# Altium project Current_source_koncar.PrjPcb (part 3 of 4)

## Sheet power.SchDoc
size 381 x 241 mm; SheetNumber: 6; SheetTotal: 12
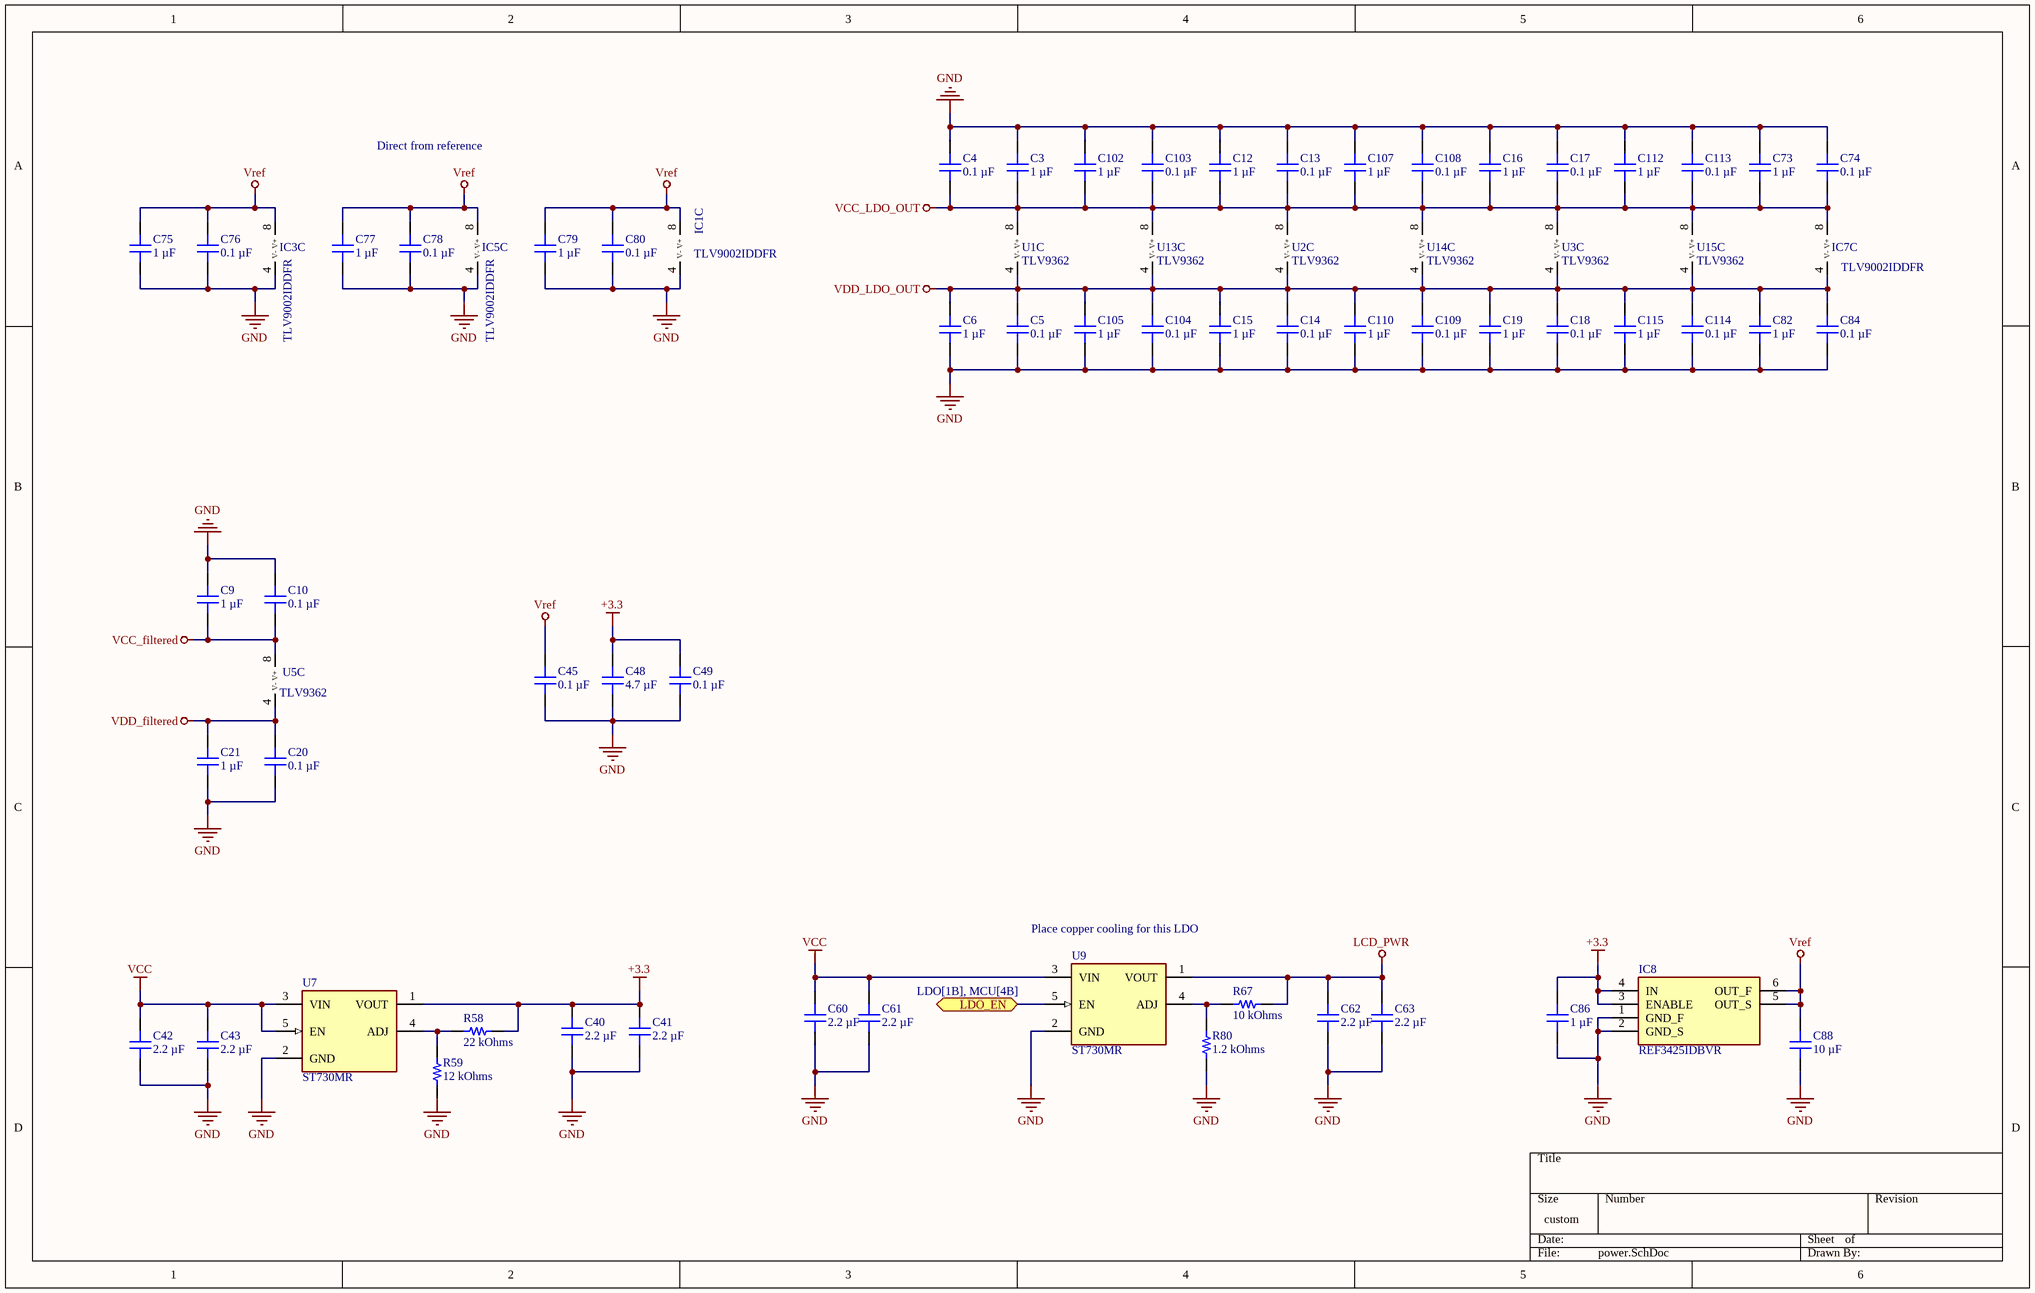
[diagram p5: power.SchDoc]

### Parts
C3  1 µF  [CAP 1206_3216 - 0.8MM]
C4  0.1 µF  [CAP 1206_3216 - 0.8MM]
C5  0.1 µF  [CAP 1206_3216 - 0.8MM]
C6  1 µF  [CAP 1206_3216 - 0.8MM]
C9  1 µF  [CAP 1206_3216 - 0.8MM]
C10  0.1 µF  [CAP 1206_3216 - 0.8MM]
C12  1 µF  [CAP 1206_3216 - 0.8MM]
C13  0.1 µF  [CAP 1206_3216 - 0.8MM]
C14  0.1 µF  [CAP 1206_3216 - 0.8MM]
C15  1 µF  [CAP 1206_3216 - 0.8MM]
C16  1 µF  [CAP 1206_3216 - 0.8MM]
C17  0.1 µF  [CAP 1206_3216 - 0.8MM]
C18  0.1 µF  [CAP 1206_3216 - 0.8MM]
C19  1 µF  [CAP 1206_3216 - 0.8MM]
C20  0.1 µF  [CAP 1206_3216 - 0.8MM]
C21  1 µF  [CAP 1206_3216 - 0.8MM]
C40  2.2 µF  [CAP 1206_3216 - 0.8MM]
C41  2.2 µF  [CAP 1206_3216 - 0.8MM]
C42  2.2 µF  [CAP 1206_3216 - 0.8MM]
C43  2.2 µF  [CAP 1206_3216 - 0.8MM]
C45  0.1 µF  [CAP 1206_3216 - 0.8MM]
C48  4.7 µF  [CAP 1206_3216 - 0.8MM]
C49  0.1 µF  [CAP 1206_3216 - 0.8MM]
C60  2.2 µF  [CAP 1206_3216 - 0.8MM]
C61  2.2 µF  [CAP 1206_3216 - 0.8MM]
C62  2.2 µF  [CAP 1206_3216 - 0.8MM]
C63  2.2 µF  [CAP 1206_3216 - 0.8MM]
C73  1 µF  [CAP 1206_3216 - 0.8MM]
C74  0.1 µF  [CAP 1206_3216 - 0.8MM]
C75  1 µF  [CAP 1206_3216 - 0.8MM]
C76  0.1 µF  [CAP 1206_3216 - 0.8MM]
C77  1 µF  [CAP 1206_3216 - 0.8MM]
C78  0.1 µF  [CAP 1206_3216 - 0.8MM]
C79  1 µF  [CAP 1206_3216 - 0.8MM]
C80  0.1 µF  [CAP 1206_3216 - 0.8MM]
C82  1 µF  [CAP 1206_3216 - 0.8MM]
C84  0.1 µF  [CAP 1206_3216 - 0.8MM]
C86  1 µF  [CAP 1206_3216 - 0.8MM]
C88  10 µF  [CAP 1206_3216 - 0.8MM]
C102  1 µF  [CAP 1206_3216 - 0.8MM]
C103  0.1 µF  [CAP 1206_3216 - 0.8MM]
C104  0.1 µF  [CAP 1206_3216 - 0.8MM]
C105  1 µF  [CAP 1206_3216 - 0.8MM]
C107  1 µF  [CAP 1206_3216 - 0.8MM]
C108  0.1 µF  [CAP 1206_3216 - 0.8MM]
C109  0.1 µF  [CAP 1206_3216 - 0.8MM]
C110  1 µF  [CAP 1206_3216 - 0.8MM]
C112  1 µF  [CAP 1206_3216 - 0.8MM]
C113  0.1 µF  [CAP 1206_3216 - 0.8MM]
C114  0.1 µF  [CAP 1206_3216 - 0.8MM]
C115  1 µF  [CAP 1206_3216 - 0.8MM]
IC1  TLV9002IDDFR  [SOT65P280X110-8N]  (part C of 3)
IC3  TLV9002IDDFR  [SOT65P280X110-8N]  (part C of 3)
IC5  TLV9002IDDFR  [SOT65P280X110-8N]  (part C of 3)
IC7  TLV9002IDDFR  [SOT65P280X110-8N]  (part C of 3)
IC8  REF3425IDBVR  [SOT95P280X145-6N]
R58  22 kOhms  [YAGEO RES 1206_3216]
R59  12 kOhms  [YAGEO RES 1206_3216]
R67  10 kOhms  [YAGEO RES 1206_3216]
R80  1.2 kOhms  [YAGEO RES 1206_3216]
U1  TLV9362  [SOIC8-127P600X175-8N]  (part C of 3)
U2  TLV9362  [SOIC8-127P600X175-8N]  (part C of 3)
U3  TLV9362  [SOIC8-127P600X175-8N]  (part C of 3)
U5  TLV9362  [SOIC8-127P600X175-8N]  (part C of 3)
U7  ST730MR  [FP-UJ-5-IPC_B]
U9  ST730MR  [FP-UJ-5-IPC_B]
U13  TLV9362  [SOIC8-127P600X175-8N]  (part C of 3)
U14  TLV9362  [SOIC8-127P600X175-8N]  (part C of 3)
U15  TLV9362  [SOIC8-127P600X175-8N]  (part C of 3)

### Ports
LDO_EN (bidir, see LDO[1B], MCU[4B])

### Nets
+3.3: C40.2 C41.2 C48.2 C49.2 C86.2 IC8.3(ENABLE) IC8.4(IN) R58.2 U7.1(VOUT)
GND: C3.1 C4.1 C5.2 C6.2 C9.2 C10.2 C12.2 C13.2 C14.2 C15.2 C16.2 C17.2 C18.2 C19.2 C20.1 C21.1 C40.1 C41.1 C42.1 C43.1 C45.1 C48.1 C49.1 C60.1 C61.1 C62.1 C63.1 C73.2 C74.2 C75.1 C76.1 C77.1 C78.1 C79.1 C80.1 C82.2 C84.2 C86.1 C88.1 C102.2 C103.2 C104.2 C105.2 C107.2 C108.2 C109.2 C110.2 C112.2 C113.2 C114.2 C115.2 IC1.4(V-) IC3.4(V-) IC5.4(V-) IC8.1(GND_F) IC8.2(GND_S) R59.2 R80.2 U7.2(GND) U9.2(GND)
LCD_PWR: C62.2 C63.2 R67.2 U9.1(VOUT)
VCC: C42.2 C43.2 C60.2 C61.2 U7.3(VIN) U7.5(EN) U9.3(VIN)
VCC_filtered: C9.1 C10.1 U5.8(V+)
VCC_LDO_OUT: C3.2 C4.2 C12.1 C13.1 C16.1 C17.1 C73.1 C74.1 C102.1 C103.1 C107.1 C108.1 C112.1 C113.1 IC7.8(V+) U1.8(V+) U2.8(V+) U3.8(V+) U13.8(V+) U14.8(V+) U15.8(V+)
VDD_filtered: C20.2 C21.2 U5.4(V-)
VDD_LDO_OUT: C5.1 C6.1 C14.1 C15.1 C18.1 C19.1 C82.1 C84.1 C104.1 C105.1 C109.1 C110.1 C114.1 C115.1 IC7.4(V-) U1.4(V-) U2.4(V-) U3.4(V-) U13.4(V-) U14.4(V-) U15.4(V-)
Vref: C45.2 C75.2 C76.2 C77.2 C78.2 C79.2 C80.2 C88.2 IC1.8(V+) IC3.8(V+) IC5.8(V+) IC8.5(OUT_S) IC8.6(OUT_F)
LDO_EN: U9.5(EN) ; port LDO_EN
NetR58_1: R58.1 R59.1 U7.4(ADJ)
NetR67_1: R67.1 R80.1 U9.4(ADJ)

### Notes on the sheet
- Direct from reference
- (near U9) Place copper cooling for this LDO

### Library data of the parts
C3 C6 C9 C12 C15 C16 C19 C21 C73 C75 C77 C79 C82 C86 C102 C105 C107 C110 C112 C115 = 885012208093: CAP CER 1UF 50V X7R 1206; manufacturer: Würth Elektronik; Tolerance: ±10%; Part Number: 885012208093; Capacitance: 1 µF; Applications: General Purpose; componentlink1description: Datasheet; componentlink1url: https://katalog.we-online.de/pbs/datasheet/885012208093.pdf; componentlink2description: DigiKey Link; componentlink2url: https://www.digikey.com/en/products/detail/würth-elektronik/885012208093/5453432; Device Package: 1206 (3216 Metric); lastupdated: 6/4/2024 19:10:33; Lifecycle Status: Active; Minimum Order: 1; Mounting Type: Surface Mount, MLCC; Operating Temperature: -55°C ~ 125°C; Package / Case: 1206 (3216 Metric); packaging: TapeAndReel; partid: 39665; Part Status: Active; price: 0.10; series: WCAP-CSGP; Size / Dimension: 0.126" L x 0.063" W (3.20mm x 1.60mm); Supplier 1: DigiKey; Supplier Part Number 1: 732-7577-1-ND; Temperature Coefficient: X7R; Thickness (Max): 0.075" (1.90mm); value: 1 µF; Voltage - Rated: 50V
C4 C5 C10 C13 C14 C17 C18 C20 C45 C49 C74 C76 C78 C80 C84 C103 C104 C108 C109 C113 C114 = 885012208087: CAP CER 0.1UF 50V X7R 1206; manufacturer: Würth Elektronik; Tolerance: ±10%; Part Number: 885012208087; Capacitance: 0.1 µF; Applications: General Purpose; componentlink1description: Datasheet; componentlink1url: https://katalog.we-online.de/pbs/datasheet/885012208087.pdf; componentlink2description: DigiKey Link; componentlink2url: https://www.digikey.com/en/products/detail/würth-elektronik/885012208087/5453982; Device Package: 1206 (3216 Metric); lastupdated: 6/4/2024 19:10:27; Lifecycle Status: Active; Minimum Order: 1; Mounting Type: Surface Mount, MLCC; Operating Temperature: -55°C ~ 125°C; Package / Case: 1206 (3216 Metric); packaging: TapeAndReel; partid: 20879; Part Status: Active; price: 0.06; series: WCAP-CSGP; Size / Dimension: 0.126" L x 0.063" W (3.20mm x 1.60mm); Supplier 1: DigiKey; Supplier Part Number 1: 732-8127-1-ND; Temperature Coefficient: X7R; Thickness (Max): 0.035" (0.90mm); value: 0.1 µF; Voltage - Rated: 50V
C40-C43 C60-C63 = 885382208001: CAP CER 2.2UF 25V X7R 1206; manufacturer: Würth Elektronik; Tolerance: ±10%; Part Number: 885382208001; Capacitance: 2.2 µF; Applications: Boardflex Sensitive; componentlink2description: DigiKey Link; componentlink2url: https://www.digikey.com/en/products/detail/würth-elektronik/885382208001/9816354; Device Package: 1206 (3216 Metric); Features: Soft Termination; lastupdated: 6/4/2024 19:10:38; Lifecycle Status: Active; Minimum Order: 1; Mounting Type: Surface Mount, MLCC; Operating Temperature: -55°C ~ 125°C; Package / Case: 1206 (3216 Metric); packaging: TapeAndReel; partid: 45904; Part Status: Active; price: 0.35; series: WCAP-CSST; Size / Dimension: 0.126" L x 0.063" W (3.20mm x 1.60mm); Supplier 1: DigiKey; Supplier Part Number 1: 732-13199-1-ND; Temperature Coefficient: X7R; Thickness (Max): 0.083" (2.10mm); value: 2.2 µF; Voltage - Rated: 25V
C48 = 885012208094: CAP CER 4.7UF 50V X7R 1206; manufacturer: Würth Elektronik; Tolerance: ±10%; Part Number: 885012208094; Capacitance: 4.7 µF; Applications: General Purpose; componentlink1description: Datasheet; componentlink1url: https://katalog.we-online.de/pbs/datasheet/885012208094.pdf; componentlink2description: DigiKey Link; componentlink2url: https://www.digikey.com/en/products/detail/würth-elektronik/885012208094/5453433; Device Package: 1206 (3216 Metric); lastupdated: 6/4/2024 19:10:35; Lifecycle Status: Active; Minimum Order: 1; Mounting Type: Surface Mount, MLCC; Operating Temperature: -55°C ~ 125°C; Package / Case: 1206 (3216 Metric); packaging: TapeAndReel; partid: 31399; Part Status: Active; price: 0.36; series: WCAP-CSGP; Size / Dimension: 0.126" L x 0.063" W (3.20mm x 1.60mm); Supplier 1: DigiKey; Supplier Part Number 1: 732-7578-1-ND; Temperature Coefficient: X7R; Thickness (Max): 0.075" (1.90mm); value: 4.7 µF; Voltage - Rated: 50V
C88 = 885012208069: CAP CER 10UF 25V X7R 1206; manufacturer: Würth Elektronik; Tolerance: ±10%; Part Number: 885012208069; Capacitance: 10 µF; Applications: General Purpose; componentlink1description: Datasheet; componentlink1url: https://katalog.we-online.de/pbs/datasheet/885012208069.pdf; componentlink2description: DigiKey Link; componentlink2url: https://www.digikey.com/en/products/detail/würth-elektronik/885012208069/5453429; Device Package: 1206 (3216 Metric); lastupdated: 6/4/2024 19:10:32; Lifecycle Status: Active; Minimum Order: 1; Mounting Type: Surface Mount, MLCC; Operating Temperature: -55°C ~ 125°C; Package / Case: 1206 (3216 Metric); packaging: TapeAndReel; partid: 43199; Part Status: Active; price: 0.40; series: WCAP-CSGP; Size / Dimension: 0.126" L x 0.063" W (3.20mm x 1.60mm); Supplier 1: DigiKey; Supplier Part Number 1: 732-7574-1-ND; Temperature Coefficient: X7R; Thickness (Max): 0.075" (1.90mm); value: 10 µF; Voltage - Rated: 25V
IC1 IC3 IC5 IC7 = TLV9002IDDFR: Integrated Circuit; Manufacturer_Name: Texas Instruments; Datasheet Link: https://www.ti.com/lit/gpn/TLV9002; Height: 1.1mm; Manufacturer_Part_Number: TLV9002IDDFR; Mouser Part Number: 595-TLV9002IDDFR; Mouser Price/Stock: https://www.mouser.co.uk/ProductDetail/Texas-Instruments/TLV9002IDDFR?qs=mAH9sUMRCtuVJ6NmNV%252Bgrw%3D%3D; Arrow Part Number: TLV9002IDDFR; Arrow Price/Stock: https://www.arrow.com/en/products/tlv9002iddfr/texas-instruments?utm_currency=USD&region=nac
IC8 = REF3425IDBVR: Integrated Circuit; Manufacturer_Name: Texas Instruments; Datasheet Link: http://www.ti.com/lit/ds/symlink/ref3425.pdf; Height: 1.45mm; Manufacturer_Part_Number: REF3425IDBVR; Mouser Part Number: 595-REF3425IDBVR; Mouser Price/Stock: https://www.mouser.co.uk/ProductDetail/Texas-Instruments/REF3425IDBVR?qs=YCa%2FAAYMW01YJo5s3bO8wA%3D%3D; Arrow Part Number: REF3425IDBVR; Arrow Price/Stock: https://www.arrow.com/en/products/ref3425idbvr/texas-instruments?region=nac
R58 = RT1206FRE0722KL: RES SMD 22K OHM 1% 1/4W 1206; Manufacturer: Yageo; Power (Watts): 0.25W, 1/4W; Temperature Coefficient: ±50ppm/°C; Part Number: RT1206FRE0722KL; ComponentLink1Description: Datasheet; ComponentLink1URL: https://www.yageo.com/upload/media/product/productsearch/datasheet/rchip/PYu-RT_1-to-0.01_RoHS_L_12.pdf; ComponentLink2Description: DigiKey Link; ComponentLink2URL: https://www.digikey.com/en/products/detail/yageo/RT1206FRE0722KL/1083042; Composition: Thin Film; Device Package: 1206 (3216 Metric); Height - Seated (Max): 0.026" (0.65mm); LastUpdated: 7/25/2024 09:21:19; Lifecycle Status: Active; Minimum Order: 1; Number of Terminations: 2; Operating Temperature: -55°C ~ 155°C; Package / Case: 1206 (3216 Metric); Packaging: TapeAndReel; PartId: 69172; Price: 0.01; Resistance: 22 kOhms; Series: RT; Size / Dimension: 0.122" L x 0.063" W (3.10mm x 1.60mm); Supplier 1: DigiKey; Supplier Part Number 1: 13-RT1206FRE0722KLCT-ND; Supplier Device Package: 1206; Tolerance: ±1%; Value: 22 kOhms; Part Status: Active
R59 = RT1206FRE0712KL: RES SMD 12K OHM 1% 1/4W 1206; Manufacturer: Yageo; Power (Watts): 0.25W, 1/4W; Temperature Coefficient: ±50ppm/°C; Part Number: RT1206FRE0712KL; ComponentLink1Description: Datasheet; ComponentLink1URL: https://www.yageo.com/upload/media/product/productsearch/datasheet/rchip/PYu-RT_1-to-0.01_RoHS_L_12.pdf; ComponentLink2Description: DigiKey Link; ComponentLink2URL: https://www.digikey.com/en/products/detail/yageo/RT1206FRE0712KL/1082900; Composition: Thin Film; Device Package: 1206 (3216 Metric); Height - Seated (Max): 0.026" (0.65mm); LastUpdated: 7/25/2024 09:21:22; Lifecycle Status: Active; Minimum Order: 1; Number of Terminations: 2; Operating Temperature: -55°C ~ 155°C; Package / Case: 1206 (3216 Metric); Packaging: TapeAndReel; PartId: 58377; Part Status: Active; Price: 0.01; Resistance: 12 kOhms; Series: RT; Size / Dimension: 0.122" L x 0.063" W (3.10mm x 1.60mm); Supplier 1: DigiKey; Supplier Part Number 1: 13-RT1206FRE0712KLCT-ND; Supplier Device Package: 1206; Tolerance: ±1%; Value: 12 kOhms
R67 = RT1206FRE0710KL: RES SMD 10K OHM 1% 1/4W 1206; Manufacturer: Yageo; Power (Watts): 0.25W, 1/4W; Temperature Coefficient: ±50ppm/°C; Part Number: RT1206FRE0710KL; ComponentLink1Description: Datasheet; ComponentLink1URL: https://www.yageo.com/upload/media/product/productsearch/datasheet/rchip/PYu-RT_1-to-0.01_RoHS_L_11.pdf; ComponentLink2Description: DigiKey Link; ComponentLink2URL: https://www.digikey.com/en/products/detail/yageo/RT1206FRE0710KL/1082868; Composition: Thin Film; Device Package: 1206 (3216 Metric); Height - Seated (Max): 0.026" (0.65mm); LastUpdated: 7/25/2024 09:21:28; Lifecycle Status: Active; Minimum Order: 1; Number of Terminations: 2; Operating Temperature: -55°C ~ 155°C; Package / Case: 1206 (3216 Metric); Packaging: TapeAndReel; PartId: 38903; Part Status: Active; Price: 0.01; Resistance: 10 kOhms; Series: RT; Size / Dimension: 0.122" L x 0.063" W (3.10mm x 1.60mm); Supplier 1: DigiKey; Supplier Part Number 1: YAG1242CT-ND; Supplier Device Package: 1206; Tolerance: ±1%; Value: 10 kOhms
R80 = RT1206FRE071K2L: RES SMD 1.2K OHM 1% 1/4W 1206; Manufacturer: Yageo; Power (Watts): 0.25W, 1/4W; Temperature Coefficient: ±50ppm/°C; Part Number: RT1206FRE071K2L; ComponentLink1Description: Datasheet; ComponentLink1URL: https://www.yageo.com/upload/media/product/productsearch/datasheet/rchip/PYu-RT_1-to-0.01_RoHS_L_12.pdf; ComponentLink2Description: DigiKey Link; ComponentLink2URL: https://www.digikey.com/en/products/detail/yageo/RT1206FRE071K2L/1082995; Composition: Thin Film; Device Package: 1206 (3216 Metric); Height - Seated (Max): 0.026" (0.65mm); LastUpdated: 7/25/2024 09:21:22; Lifecycle Status: Active; Minimum Order: 1; Number of Terminations: 2; Operating Temperature: -55°C ~ 155°C; Package / Case: 1206 (3216 Metric); Packaging: TapeAndReel; PartId: 58383; Part Status: Active; Price: 0.01; Resistance: 1.2 kOhms; Series: RT; Size / Dimension: 0.122" L x 0.063" W (3.10mm x 1.60mm); Supplier 1: DigiKey; Supplier Part Number 1: 13-RT1206FRE071K2LCT-ND; Supplier Device Package: 1206; Tolerance: ±1%; Value: 1.2 kOhms
U1-U3 U5 U13-U15 = TLV9362: TLV936x 10-MHz, 40-V, RRO, Operational Amplifie; ComponentLink1Description: Datasheet; ComponentLink1URL: https://www.ti.com/lit/ds/symlink/tlv9362.pdf

## Sheet MCU.SchDoc
size A; SheetNumber: 7; SheetTotal: 10
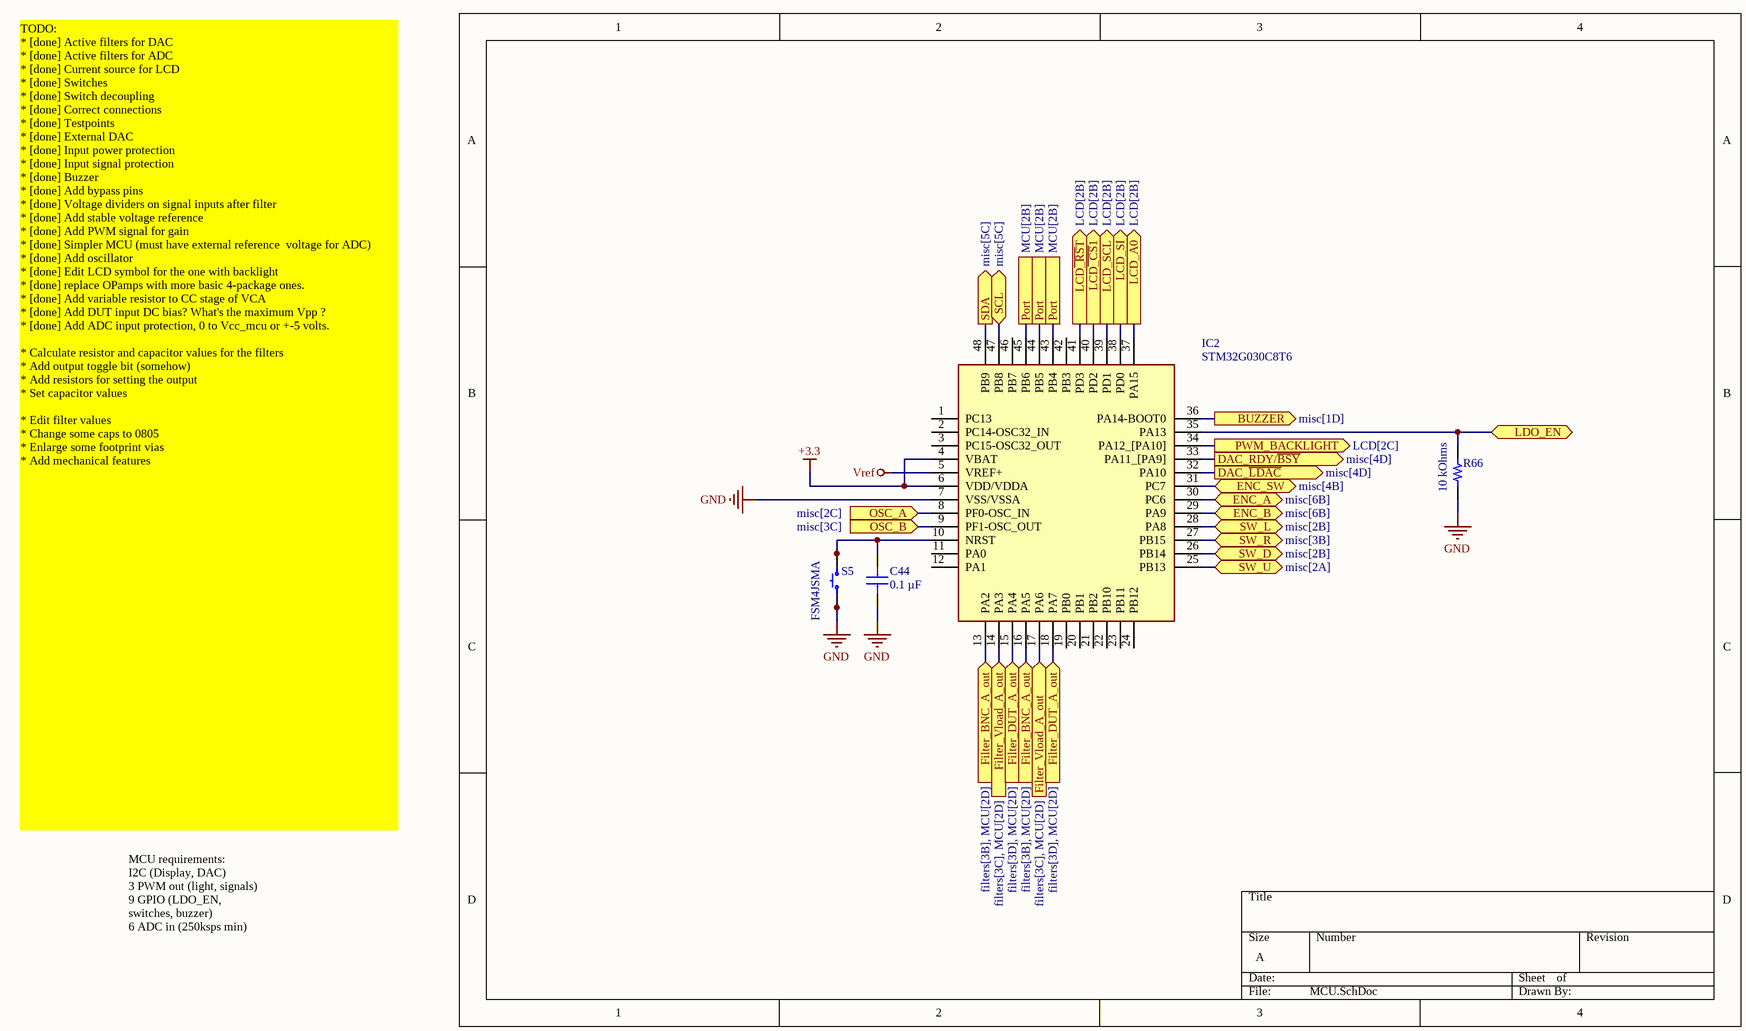
[diagram p6: MCU.SchDoc]

### Parts
C44  0.1 µF  [CAP 1206_3216 - 0.8MM]
IC2  STM32G030C8T6  [QFP50P900X900X160-48N]
R66  10 kOhms  [YAGEO RES 1206_3216]
S5  FSM4JSMA  [TE FSM4JSMA]

### Ports
BUZZER (out, see misc[1D]), DAC_RDY/~{BSY} (out, see misc[4D]), DAC_~{LDAC} (out, see misc[4D]), ENC_A (bidir, see misc[6B]), ENC_B (bidir, see misc[6B]), ENC_SW (bidir, see misc[4B]), Filter_BNC_A_out (in, see filters[3B], MCU[2D]), Filter_DUT_A_out (in, see filters[3D], MCU[2D]), Filter_Vload_A_out (in, see filters[3C], MCU[2D]), LCD_A0 (out, see LCD[2B]), LCD_SCL (out, see LCD[2B]), LCD_SI (out, see LCD[2B]), LCD~{_CS}1 (out, see LCD[2B]), LCD~{_RS}T (out, see LCD[2B]), LDO_EN (bidir, see LDO[3B], LDO[3C], power[3D]), OSC_A (in, see misc[2C]), OSC_B (in, see misc[3C]), Port (see MCU[2B]), PWM_BACKLIGHT (out, see LCD[2C]), SCL (bidir, see misc[5C]), SDA (out, see misc[5C]), SW_D (bidir, see misc[2B]), SW_L (bidir, see misc[2B]), SW_R (bidir, see misc[3B]), SW_U (bidir, see misc[2A])

### Nets
+3.3: IC2.4(VBAT) IC2.6(VDD/VDDA)
GND: C44.1 IC2.7(VSS/VSSA) R66.2 S5.1 S5.2
Vref: IC2.5(VREF+)
LCD~{_CS}1: IC2.40(PD2) ; port LCD~{_CS}1
LCD~{_RS}T: IC2.41(PD3) ; port LCD~{_RS}T
LCD_A0: IC2.37(PA15) ; port LCD_A0
LCD_SCL: IC2.39(PD1) ; port LCD_SCL
LCD_SI: IC2.38(PD0) ; port LCD_SI
LDO_EN: IC2.35(PA13) R66.1 ; port LDO_EN
NetC44_2: C44.2 IC2.10(NRST) S5.3 S5.4
NetC52_1: IC2.8(PF0-OSC_IN) ; port OSC_A
NetC53_2: IC2.9(PF1-OSC_OUT) ; port OSC_B
NetC69_2: IC2.29(PA9) ; port ENC_B
NetC70_2: IC2.30(PC6) ; port ENC_A
NetC81_1: IC2.14(PA3) IC2.17(PA6) ; port Filter_Vload_A_out
NetC85_1: IC2.15(PA4) IC2.18(PA7) ; port Filter_DUT_A_out
NetC?#3_1: IC2.13(PA2) IC2.16(PA5) ; port Filter_BNC_A_out
NetIC2_25: IC2.25(PB13) ; port SW_U
NetIC2_26: IC2.26(PB14) ; port SW_D
NetIC2_27: IC2.27(PB15) ; port SW_R
NetIC2_28: IC2.28(PA8) ; port SW_L
NetIC2_31: IC2.31(PC7) ; port ENC_SW
NetIC2_32: IC2.32(PA10) ; port DAC_~{LDAC}
NetIC2_33: IC2.33(PA11_[PA9]) ; port DAC_RDY/~{BSY}
NetIC2_34: IC2.34(PA12_[PA10]) ; port PWM_BACKLIGHT
NetIC2_36: IC2.36(PA14-BOOT0) ; port BUZZER
NetIC2_43: IC2.43(PB4) IC2.44(PB5) IC2.45(PB6) ; port Port
NetIC2_47: IC2.47(PB8) ; port SCL
NetIC2_48: IC2.48(PB9) ; port SDA

Not connected (* = marked no-connect by the designer): IC2 1(PC13) 2(PC14-OSC32_IN) 3(PC15-OSC32_OUT) 11(PA0) 12(PA1) 19(PB0) 20(PB1) 21(PB2) 22(PB10) 23(PB11) 24(PB12) 42(PB3) 46(PB7)

### Notes on the sheet
- TODO:
  * [done] Active filters for DAC
  * [done] Active filters for ADC
  * [done] Current source for LCD
  * [done] Switches
  * [done] Switch decoupling
  * [done] Correct connections
  * [done] Testpoints
  * [done] External DAC
  * [done] Input power protection
  * [done] Input signal protection
  * [done] Buzzer
  * [done] Add bypass pins
  * [done] Voltage dividers on signal inputs after filter
  * [done] Add stable voltage reference
  * [done] Add PWM signal for gain
  * [done] Simpler MCU (must have external reference  voltage for ADC)
  * [done] Add oscillator
  * [done] Edit LCD symbol for the one with backlight
  * [done] replace OPamps with more basic 4-package ones.
  * [done] Add variable resistor to CC stage of VCA
  * [done] Add DUT input DC bias? What's the maximum Vpp ?
  * [done] Add ADC input protection, 0 to Vcc_mcu or +-5 volts.
  * Calculate resistor and capacitor values for the filters
  * Add output toggle bit (somehow)
  * Add resistors for setting the output
  * Set capacitor values
  * Edit filter values
  * Change some caps to 0805
  * Enlarge some footprint vias
  * Add mechanical features
- MCU requirements:
  I2C (Display, DAC)
  3 PWM out (light, signals)
  9 GPIO (LDO_EN, switches, buzzer)
  6 ADC in (250ksps min)

### Library data of the parts
C44 = 885012208087: as C4 on sheet power; Part Number: 885012208087; Capacitance: 0.1 µF; Applications: General Purpose; componentlink1description: Datasheet; componentlink1url: https://katalog.we-online.de/pbs/datasheet/885012208087.pdf; componentlink2description: DigiKey Link; componentlink2url: https://www.digikey.com/en/products/detail/würth-elektronik/885012208087/5453982; Device Package: 1206 (3216 Metric); lastupdated: 6/4/2024 19:10:27; Lifecycle Status: Active; Minimum Order: 1; Mounting Type: Surface Mount, MLCC; Operating Temperature: -55°C ~ 125°C; Package / Case: 1206 (3216 Metric); packaging: TapeAndReel; partid: 20879; Part Status: Active; price: 0.06; series: WCAP-CSGP; Size / Dimension: 0.126" L x 0.063" W (3.20mm x 1.60mm); Supplier 1: DigiKey; Supplier Part Number 1: 732-8127-1-ND; Temperature Coefficient: X7R; Thickness (Max): 0.035" (0.90mm); value: 0.1 µF; Voltage - Rated: 50V
IC2 = STM32G030C8T6: Integrated Circuit; Manufacturer_Name: STMicroelectronics; Datasheet Link: https://componentsearchengine.com/Datasheets/1/STM32G030C8T6.pdf; Height: 1.6mm; Manufacturer_Part_Number: STM32G030C8T6; Mouser Part Number: 511-STM32G030C8T6; Mouser Price/Stock: https://www.mouser.co.uk/ProductDetail/STMicroelectronics/STM32G030C8T6?qs=uwxL4vQweFMKBA8wRRkiWA%3D%3D; Arrow Part Number: STM32G030C8T6; Arrow Price/Stock: https://www.arrow.com/en/products/stm32g030c8t6/stmicroelectronics?utm_currency=USD&region=nac
R66 = RT1206FRE0710KL: as R67 on sheet power; Part Number: RT1206FRE0710KL; ComponentLink1Description: Datasheet; ComponentLink1URL: https://www.yageo.com/upload/media/product/productsearch/datasheet/rchip/PYu-RT_1-to-0.01_RoHS_L_11.pdf; ComponentLink2Description: DigiKey Link; ComponentLink2URL: https://www.digikey.com/en/products/detail/yageo/RT1206FRE0710KL/1082868; Composition: Thin Film; Device Package: 1206 (3216 Metric); Height - Seated (Max): 0.026" (0.65mm); LastUpdated: 7/25/2024 09:21:28; Lifecycle Status: Active; Minimum Order: 1; Number of Terminations: 2; Operating Temperature: -55°C ~ 155°C; Package / Case: 1206 (3216 Metric); Packaging: TapeAndReel; PartId: 38903; Part Status: Active; Price: 0.01; Resistance: 10 kOhms; Series: RT; Size / Dimension: 0.122" L x 0.063" W (3.10mm x 1.60mm); Supplier 1: DigiKey; Supplier Part Number 1: YAG1242CT-ND; Supplier Device Package: 1206; Tolerance: ±1%; Value: 10 kOhms
S5 = FSM4JSMA: SWITCH TACTILE SPST-NO 0.05A 24V; Manufacturer: TE Connectivity ALCOSWITCH Switches; Actuator Height off PCB, Vertical: 5.00mm; Actuator Orientation: Top Actuated; Actuator Type: Standard; Contact Rating @ Voltage: 0.05A @ 24VDC; Illumination: Non-Illuminated; Operating Force: 160gf; Outline: 6.00mm x 6.00mm; Switch Function: Off-Mom; Part Number: FSM4JSMA; Circuit: SPST-NO; ComponentLink1Description: Datasheet; ComponentLink1URL: https://www.te.com/commerce/DocumentDelivery/DDEController?Action=srchrtrv&DocNm=1308111-1_SWITCHES_CORE_PROGRAM_CATALOG&DocType=CS&DocLang=English; ComponentLink2Description: DigiKey Link; ComponentLink2URL: https://www.digikey.com/en/products/detail/te-connectivity-alcoswitch-switches/FSM4JSMA/525821; LastUpdated: 6/3/2024 20:19:31; Lifecycle Status: Active; Minimum Order: 1; Mounting Type: Surface Mount; Operating Temperature: -35°C ~ 85°C; Packaging: Bulk; Part Status: Active; Price: 0.14; Series: FSMJSMA; Supplier 1: DigiKey; Supplier Part Number 1: 450-1129-ND; Termination Style: Gull Wing

## Sheet LDO.SchDoc
size 381 x 241 mm; SheetNumber: 8; SheetTotal: 12
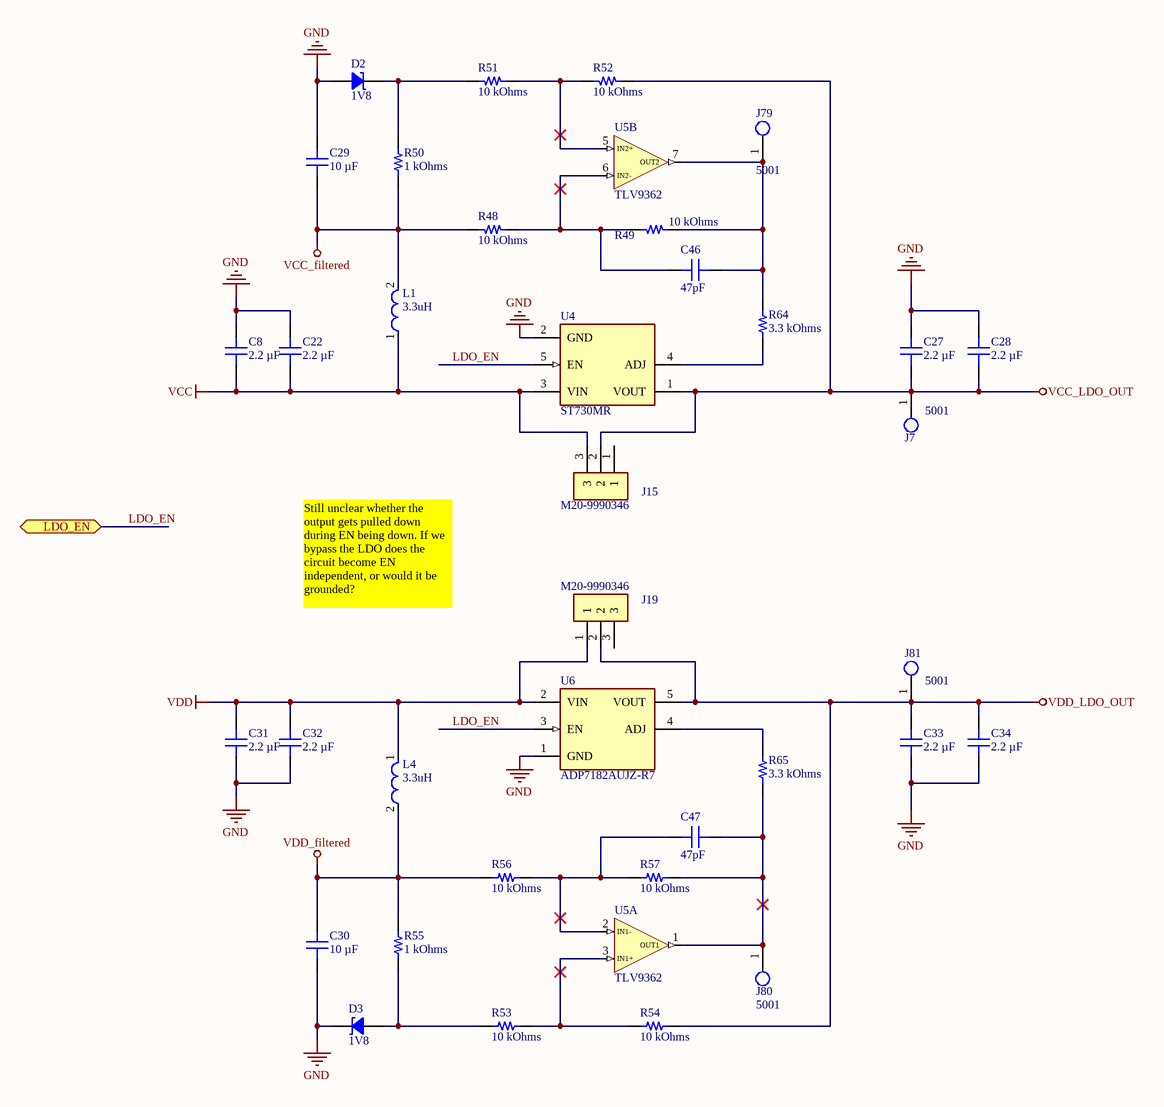
[diagram p7: LDO.SchDoc]

### Parts
C8  2.2 µF  [CAP 1206_3216 - 0.8MM]
C22  2.2 µF  [CAP 1206_3216 - 0.8MM]
C27  2.2 µF  [CAP 1206_3216 - 0.8MM]
C28  2.2 µF  [CAP 1206_3216 - 0.8MM]
C29  10 µF  [CAP 1206_3216 - 0.8MM]
C30  10 µF  [CAP 1206_3216 - 0.8MM]
C31  2.2 µF  [CAP 1206_3216 - 0.8MM]
C32  2.2 µF  [CAP 1206_3216 - 0.8MM]
C33  2.2 µF  [CAP 1206_3216 - 0.8MM]
C34  2.2 µF  [CAP 1206_3216 - 0.8MM]
C46  47pF  [CAP 1206_3216 - 1.8MM]
C47  47pF  [CAP 1206_3216 - 1.8MM]
D2  1V8  [SOD323]
D3  1V8  [SOD323]
J7  5001  [FP-5001-MFG]
J15  M20-9990346  [HDRV3W64P0X254_1X3_762X254X864P]
J19  M20-9990346  [HDRV3W64P0X254_1X3_762X254X864P]
J79  5001  [FP-5001-MFG]
J80  5001  [FP-5001-MFG]
J81  5001  [FP-5001-MFG]
L1  3.3uH  [FP-MLZ2012-1_25-IPC_B]
L4  3.3uH  [FP-MLZ2012-1_25-IPC_B]
R48  10 kOhms  [YAGEO RES 1206_3216]
R49  10 kOhms  [YAGEO RES 1206_3216]
R50  1 kOhms  [YAGEO RES 1206_3216]
R51  10 kOhms  [YAGEO RES 1206_3216]
R52  10 kOhms  [YAGEO RES 1206_3216]
R53  10 kOhms  [YAGEO RES 1206_3216]
R54  10 kOhms  [YAGEO RES 1206_3216]
R55  1 kOhms  [YAGEO RES 1206_3216]
R56  10 kOhms  [YAGEO RES 1206_3216]
R57  10 kOhms  [YAGEO RES 1206_3216]
R64  3.3 kOhms  [YAGEO RES 1206_3216]
R65  3.3 kOhms  [YAGEO RES 1206_3216]
U4  ST730MR  [FP-UJ-5-IPC_B]
U5  TLV9362  [SOIC8-127P600X175-8N]  (parts A,B of 3)
U6  ADP7182AUJZ-R7  [FP-UJ-5-IPC_B]

### Ports
LDO_EN (bidir, see MCU[4B], power[3D])

### Nets
GND: C8.1 C22.1 C27.1 C28.1 C29.1 C30.1 C31.1 C32.1 C33.1 C34.1 D2.1 D3.2 U4.2(GND) U6.1(GND)
VCC: C8.2 C22.2 J15.3 L1.1 U4.3(VIN)
VCC_filtered: C29.2 L1.2 R48.2 R50.1
VCC_LDO_OUT: C27.2 C28.2 J7.1 J15.2 R52.1 U4.1(VOUT)
VDD: C31.2 C32.2 J19.1 L4.1 U6.2(VIN)
VDD_filtered: C30.2 L4.2 R55.2 R56.2
VDD_LDO_OUT: C33.2 C34.2 J19.2 J81.1 R54.1 U6.5(VOUT)
LDO_EN: U4.5(EN) U6.3(EN) ; port LDO_EN
NetC46_1: C46.1 R48.1 R49.2 U5.6(IN2-)
NetC46_2: C46.2 J79.1 R49.1 R64.1 U5.7(OUT2)
NetC47_1: C47.1 R56.1 R57.2 U5.2(IN1-)
NetC47_2: C47.2 J80.1 R57.1 R65.2 U5.1(OUT1)
NetD2_2: D2.2 R50.2 R51.2
NetD3_1: D3.1 R53.2 R55.1
NetR51_1: R51.1 R52.2 U5.5(IN2+)
NetR53_1: R53.1 R54.2 U5.3(IN1+)
NetR64_2: R64.2 U4.4(ADJ)
NetR65_1: R65.1 U6.4(ADJ)

Not connected (* = marked no-connect by the designer): J15 1; J19 3

### Notes on the sheet
- Still unclear whether the output gets pulled down during EN being down. If we bypass the LDO does the circuit become EN independent, or would it be grounded?
- Type @ to refer to a designator or a net

### Library data of the parts
C8 C22 C27 C28 C31-C34 = 885382208001: as C40 on sheet power; Part Number: 885382208001; Capacitance: 2.2 µF; Applications: Boardflex Sensitive; componentlink2description: DigiKey Link; componentlink2url: https://www.digikey.com/en/products/detail/würth-elektronik/885382208001/9816354; Device Package: 1206 (3216 Metric); Features: Soft Termination; lastupdated: 6/4/2024 19:10:38; Lifecycle Status: Active; Minimum Order: 1; Mounting Type: Surface Mount, MLCC; Operating Temperature: -55°C ~ 125°C; Package / Case: 1206 (3216 Metric); packaging: TapeAndReel; partid: 45904; Part Status: Active; price: 0.35; series: WCAP-CSST; Size / Dimension: 0.126" L x 0.063" W (3.20mm x 1.60mm); Supplier 1: DigiKey; Supplier Part Number 1: 732-13199-1-ND; Temperature Coefficient: X7R; Thickness (Max): 0.083" (2.10mm); value: 2.2 µF; Voltage - Rated: 25V
C29 C30 = 885012208069: as C88 on sheet power; Part Number: 885012208069; Capacitance: 10 µF; Applications: General Purpose; componentlink1description: Datasheet; componentlink1url: https://katalog.we-online.de/pbs/datasheet/885012208069.pdf; componentlink2description: DigiKey Link; componentlink2url: https://www.digikey.com/en/products/detail/würth-elektronik/885012208069/5453429; Device Package: 1206 (3216 Metric); lastupdated: 6/4/2024 19:10:32; Lifecycle Status: Active; Minimum Order: 1; Mounting Type: Surface Mount, MLCC; Operating Temperature: -55°C ~ 125°C; Package / Case: 1206 (3216 Metric); packaging: TapeAndReel; partid: 43199; Part Status: Active; price: 0.40; series: WCAP-CSGP; Size / Dimension: 0.126" L x 0.063" W (3.20mm x 1.60mm); Supplier 1: DigiKey; Supplier Part Number 1: 732-7574-1-ND; Temperature Coefficient: X7R; Thickness (Max): 0.075" (1.90mm); value: 10 µF; Voltage - Rated: 25V
C46 C47 = 1206AA470KAT1A: CAP CER 47PF 1KV C0G/NP0 1206; manufacturer: AVX Corporation; Temperature Coefficient: C0G, NP0; Tolerance: ±10%; Voltage - Rated: 1000V (1kV); Part Number: 1206AA470KAT1A; Capacitance: 47pF; Applications: General Purpose; componentlink1description: Datasheet; componentlink1url: http://datasheets.avx.com/AVX-HV_MLCC.pdf; componentlink2description: DigiKey Link; componentlink2url: http://digikey.com/product-detail/en/avx-corporation/1206AA470KAT1A/478-2949-1-ND/808148; Device Package: 1206 (3216 Metric); Features: High Voltage; lastupdated: 9/2/2020 01:05:31; Lifecycle Status: Active; Minimum Order: 1; Mounting Type: Surface Mount, MLCC; Operating Temperature: -55°C ~ 125°C; Package / Case: 1206 (3216 Metric); packaging: TapeAndReel; partid: 21825; Part Status: Active; price: 0.11; series: -; Size / Dimension: 0.130" L x 0.063" W (3.30mm x 1.60mm); Supplier 1: DigiKey; Supplier Part Number 1: 478-2949-1-ND; Thickness (Max): 0.071" (1.80mm); value: 47pF
D2 D3 = BZX38450-C1V8X
J7 J79-J81 = CMP-2000-05181-2: PC TEST POINT MINIATURE BLACK; Body Material: Bronze; Plating: Silver; Inside Diameter: 1.27mm; Hole Diameter: 1.6mm; Number of Ports: 1; Outside Diameter: 2.54mm; Insulation: Insulated; Insulation Material: Nylon; Mount: Through Hole; RoHS Compliant: Yes; Series: THM; Height: 0.3inch; Termination: Through Hole; Material: Nylon; Packaging: Bulk; Contact Material: Bronze; REACH SVHC: No SVHC; Contact Plating: Silver; Orientation: Straight; Lead Free: Lead Free; Package Quantity: 100; Length: 7.62mm; Flammability Rating: UL94 V-0; Number of Contacts: 1; Diameter: 2.54mm; Housing Color: Black; Color: Black
J15 J19 = M20-9990346: Connector; Manufacturer_Name: Harwin; Datasheet Link: https://cdn.harwin.com/pdfs/M20-999.pdf; Height: 8.64mm; Manufacturer_Part_Number: M20-9990346; Mouser Part Number: 855-M20-9990346; Mouser Price/Stock: https://www.mouser.co.uk/ProductDetail/Harwin/M20-9990346?qs=ulE8k0yEMYbyhQ3uXpFs8Q%3D%3D
L1 L4 = MLZ2012M: Shielded Multilayer Inductor 3.3uH ±20% 500mA 260mΩ SMD 0805; Saturation Current: 350mA; Core Material: Ferrite; DC Resistance (DCR): 260mR; RoHS Compliant: Yes; Mount: Surface Mount; Case Code (Metric): 2012; Case/Package: 0805; Min Operating Temperature: -55°C; Package Quantity: 2000; Shielding: Shielded; Current Rating: 500mA; Height - Seated (Max): 0.057inch; Case Code (Imperial): 0805; Width: 0.049inch; Tolerance: 20%; Packaging: Tape and Reel; Inductance: 3.3uH; Lead Free: Lead Free; Max Operating Temperature: 125°C; Length: 0.079inch; Value: 3.3uH
R48 R49 R51-R54 R56 R57 = RT1206FRE0710KL: as R67 on sheet power; Part Number: RT1206FRE0710KL; ComponentLink1Description: Datasheet; ComponentLink1URL: https://www.yageo.com/upload/media/product/productsearch/datasheet/rchip/PYu-RT_1-to-0.01_RoHS_L_11.pdf; ComponentLink2Description: DigiKey Link; ComponentLink2URL: https://www.digikey.com/en/products/detail/yageo/RT1206FRE0710KL/1082868; Composition: Thin Film; Device Package: 1206 (3216 Metric); Height - Seated (Max): 0.026" (0.65mm); LastUpdated: 7/25/2024 09:21:28; Lifecycle Status: Active; Minimum Order: 1; Number of Terminations: 2; Operating Temperature: -55°C ~ 155°C; Package / Case: 1206 (3216 Metric); Packaging: TapeAndReel; PartId: 38903; Part Status: Active; Price: 0.01; Resistance: 10 kOhms; Series: RT; Size / Dimension: 0.122" L x 0.063" W (3.10mm x 1.60mm); Supplier 1: DigiKey; Supplier Part Number 1: YAG1242CT-ND; Supplier Device Package: 1206; Tolerance: ±1%; Value: 10 kOhms
R50 R55 = RT1206FRE071KL: RES SMD 1K OHM 1% 1/4W 1206; Manufacturer: Yageo; Power (Watts): 0.25W, 1/4W; Temperature Coefficient: ±50ppm/°C; Part Number: RT1206FRE071KL; ComponentLink1Description: Datasheet; ComponentLink1URL: https://www.yageo.com/upload/media/product/productsearch/datasheet/rchip/PYu-RT_1-to-0.01_RoHS_L_11.pdf; ComponentLink2Description: DigiKey Link; ComponentLink2URL: https://www.digikey.com/en/products/detail/yageo/RT1206FRE071KL/1083016; Composition: Thin Film; Device Package: 1206 (3216 Metric); Height - Seated (Max): 0.026" (0.65mm); LastUpdated: 7/25/2024 09:21:27; Lifecycle Status: Active; Minimum Order: 1; Number of Terminations: 2; Operating Temperature: -55°C ~ 155°C; Package / Case: 1206 (3216 Metric); Packaging: TapeAndReel; PartId: 40465; Part Status: Active; Price: 0.01; Resistance: 1 kOhms; Series: RT; Size / Dimension: 0.122" L x 0.063" W (3.10mm x 1.60mm); Supplier 1: DigiKey; Supplier Part Number 1: YAG3366CT-ND; Supplier Device Package: 1206; Tolerance: ±1%; Value: 1 kOhms
R64 R65 = RT1206FRE073K3L: RES SMD 3.3K OHM 1% 1/4W 1206; Manufacturer: Yageo; Power (Watts): 0.25W, 1/4W; Temperature Coefficient: ±50ppm/°C; Part Number: RT1206FRE073K3L; ComponentLink1Description: Datasheet; ComponentLink1URL: https://www.yageo.com/upload/media/product/productsearch/datasheet/rchip/PYu-RT_1-to-0.01_RoHS_L_12.pdf; ComponentLink2Description: DigiKey Link; ComponentLink2URL: https://www.digikey.com/en/products/detail/yageo/RT1206FRE073K3L/1083187; Composition: Thin Film; Device Package: 1206 (3216 Metric); Height - Seated (Max): 0.026" (0.65mm); LastUpdated: 7/25/2024 09:21:22; Lifecycle Status: Active; Minimum Order: 1; Number of Terminations: 2; Operating Temperature: -55°C ~ 155°C; Package / Case: 1206 (3216 Metric); Packaging: TapeAndReel; PartId: 58380; Price: 0.01; Resistance: 3.3 kOhms; Series: RT; Size / Dimension: 0.122" L x 0.063" W (3.10mm x 1.60mm); Supplier 1: DigiKey; Supplier Part Number 1: 13-RT1206FRE073K3LCT-ND; Supplier Device Package: 1206; Tolerance: ±1%; Value: 3.3 kOhms; Part Status: Active
U5 = TLV9362: as U1 on sheet power; ComponentLink1Description: Datasheet; ComponentLink1URL: https://www.ti.com/lit/ds/symlink/tlv9362.pdf
U6 = ADP7182: IC REG LIN NEG ADJ 200MA 5TSOT; Manufacturer: Analog Devices; Number Of Outputs: 1; Min Supply Voltage: -2.7V; Max Junction Temp: +125°C; Dropout Voltage: -185mV; Output Current: -200mA; Max Supply Voltage: -28V; Output Voltage: -1.22/-27.815V; Nominal Supply Current: -33/-650uA; Output Type: AdjustableProgrammable; Accuracy Percentage: 1%; RoHS: TRUE; Ambient Temperature Range Low: -40°C; Digikey Description: IC REG LIN NEG ADJ 200MA 5TSOT; Device Class L3: Voltage Regulators - Linear; Ambient Temperature Range High: +85°C; Manufacturer Part Number: ADP7182AUJZ-R7; ComponentLink2URL: https://www.analog.com/media/en/technical-documentation/data-sheets/ADP7182.pdf; Ipc Land Pattern Name: SOT95P280X100-5; Temperature Range Low: -40°C; ComponentLink2Description: Datasheet; Mouser Description: LDO Regulator Neg -1.22V to -27V 0.2A 5-Pin TSOT T/R; Category: IC; Automotive: No; Device Class L1: Integrated Circuits (ICs); Temperature: -40°C to +125°C; Octopart: https://octopart.com/adp7182aujz-r7-analog+devices-21054665; Device Class L2: Power Management ICs; Height: 1mm; Package: UJ-5; Temperature Range High: +125°C; Lead Free: Yes

## Sheet misc.SchDoc
size 381 x 241 mm; SheetNumber: 9; SheetTotal: 12
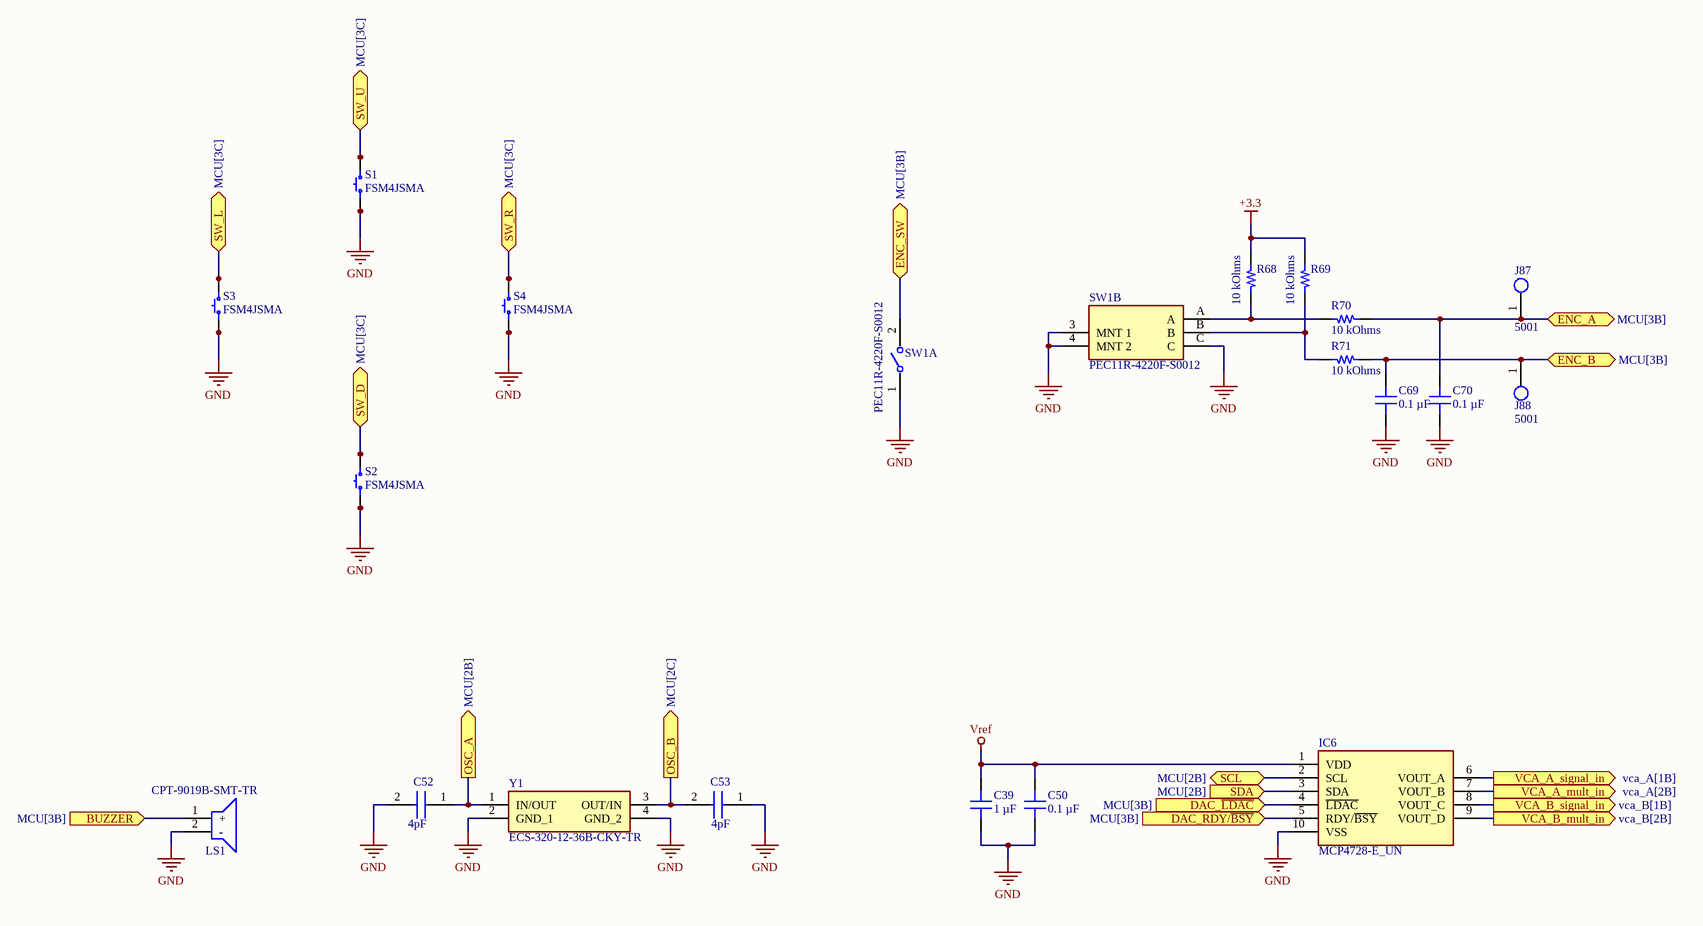
[diagram p8: misc.SchDoc]

### Parts
C39  1 µF  [CAP 1206_3216 - 0.8MM]
C50  0.1 µF  [CAP 1206_3216 - 0.8MM]
C52  4pF  [CAPC1608X80N]
C53  4pF  [CAPC1608X80N]
C69  0.1 µF  [CAP 1206_3216 - 0.8MM]
C70  0.1 µF  [CAP 1206_3216 - 0.8MM]
IC6  MCP4728-E_UN  [SOP50P490X110-10N]
J87  5001  [FP-5001-MFG]
J88  5001  [FP-5001-MFG]
LS1  CPT-9019B-SMT-TR  [CPT9019BSMTTR]
R68  10 kOhms  [YAGEO RES 1206_3216]
R69  10 kOhms  [YAGEO RES 1206_3216]
R70  10 kOhms  [YAGEO RES 1206_3216]
R71  10 kOhms  [YAGEO RES 1206_3216]
S1  FSM4JSMA  [TE FSM4JSMA]
S2  FSM4JSMA  [TE FSM4JSMA]
S3  FSM4JSMA  [TE FSM4JSMA]
S4  FSM4JSMA  [TE FSM4JSMA]
SW1  PEC11R-4220F-S0012  [FP-PEC11R-4220F-S0012-MFG]  (parts A,B of 2)
Y1  ECS-320-12-36B-CKY-TR  [ECS240836QAESTR]

### Ports
BUZZER (in, see MCU[3B]), DAC_RDY/~{BSY} (in, see MCU[3B]), DAC_~{LDAC} (in, see MCU[3B]), ENC_A (bidir, see MCU[3B]), ENC_B (bidir, see MCU[3B]), ENC_SW (bidir, see MCU[3B]), OSC_A (out, see MCU[2B]), OSC_B (out, see MCU[2C]), SCL (bidir, see MCU[2B]), SDA (in, see MCU[2B]), SW_D (bidir, see MCU[3C]), SW_L (bidir, see MCU[3C]), SW_R (bidir, see MCU[3C]), SW_U (bidir, see MCU[3C]), VCA_A_mult_in (out, see vca_A[2B]), VCA_A_signal_in (out, see vca_A[1B]), VCA_B_mult_in (out, see vca_B[2B]), VCA_B_signal_in (out, see vca_B[1B])

### Nets
+3.3: R68.1 R69.1
GND: C39.1 C50.1 C52.2 C53.1 C69.1 C70.1 IC6.10(VSS) LS1.2(-) S1.1 S1.2 S2.1 S2.2 S3.1 S3.2 S4.1 S4.2 SW1.1 SW1.3(MNT_1) SW1.4(MNT_2) SW1.C Y1.2(GND_1) Y1.4(GND_2)
Vref: C39.2 C50.2 IC6.1(VDD)
NetC52_1: C52.1 Y1.1(IN/OUT) ; port OSC_A
NetC53_2: C53.2 Y1.3(OUT/IN) ; port OSC_B
NetC69_2: C69.2 J88.1 R71.2 ; port ENC_B
NetC70_2: C70.2 J87.1 R70.2 ; port ENC_A
NetIC2_25: S1.3 S1.4 ; port SW_U
NetIC2_26: S2.3 S2.4 ; port SW_D
NetIC2_27: S4.3 S4.4 ; port SW_R
NetIC2_28: S3.3 S3.4 ; port SW_L
NetIC2_31: SW1.2 ; port ENC_SW
NetIC2_32: IC6.4(~{LDAC}) ; port DAC_~{LDAC}
NetIC2_33: IC6.5(RDY/~{BSY}) ; port DAC_RDY/~{BSY}
NetIC2_36: LS1.1(+) ; port BUZZER
NetIC2_47: IC6.2(SCL) ; port SCL
NetIC2_48: IC6.3(SDA) ; port SDA
NetIC6_6: IC6.6(VOUT_A) ; port VCA_A_signal_in
NetIC6_7: IC6.7(VOUT_B) ; port VCA_A_mult_in
NetIC6_8: IC6.8(VOUT_C) ; port VCA_B_signal_in
NetIC6_9: IC6.9(VOUT_D) ; port VCA_B_mult_in
NetR68_2: R68.2 R70.1 SW1.A
NetR69_2: R69.2 R71.1 SW1.B

### Library data of the parts
C39 = 885012208093: as C3 on sheet power; Part Number: 885012208093; Capacitance: 1 µF; Applications: General Purpose; componentlink1description: Datasheet; componentlink1url: https://katalog.we-online.de/pbs/datasheet/885012208093.pdf; componentlink2description: DigiKey Link; componentlink2url: https://www.digikey.com/en/products/detail/würth-elektronik/885012208093/5453432; Device Package: 1206 (3216 Metric); lastupdated: 6/4/2024 19:10:33; Lifecycle Status: Active; Minimum Order: 1; Mounting Type: Surface Mount, MLCC; Operating Temperature: -55°C ~ 125°C; Package / Case: 1206 (3216 Metric); packaging: TapeAndReel; partid: 39665; Part Status: Active; price: 0.10; series: WCAP-CSGP; Size / Dimension: 0.126" L x 0.063" W (3.20mm x 1.60mm); Supplier 1: DigiKey; Supplier Part Number 1: 732-7577-1-ND; Temperature Coefficient: X7R; Thickness (Max): 0.075" (1.90mm); value: 1 µF; Voltage - Rated: 50V
C50 C69 C70 = 885012208087: as C4 on sheet power; Part Number: 885012208087; Capacitance: 0.1 µF; Applications: General Purpose; componentlink1description: Datasheet; componentlink1url: https://katalog.we-online.de/pbs/datasheet/885012208087.pdf; componentlink2description: DigiKey Link; componentlink2url: https://www.digikey.com/en/products/detail/würth-elektronik/885012208087/5453982; Device Package: 1206 (3216 Metric); lastupdated: 6/4/2024 19:10:27; Lifecycle Status: Active; Minimum Order: 1; Mounting Type: Surface Mount, MLCC; Operating Temperature: -55°C ~ 125°C; Package / Case: 1206 (3216 Metric); packaging: TapeAndReel; partid: 20879; Part Status: Active; price: 0.06; series: WCAP-CSGP; Size / Dimension: 0.126" L x 0.063" W (3.20mm x 1.60mm); Supplier 1: DigiKey; Supplier Part Number 1: 732-8127-1-ND; Temperature Coefficient: X7R; Thickness (Max): 0.035" (0.90mm); value: 0.1 µF; Voltage - Rated: 50V
C52 C53 = C1608C0G1H040C080AA: Capacitor; Manufacturer_Name: TDK; Datasheet Link: https://product.tdk.com/info/en/catalog/datasheets/mlcc_commercial_midvoltage_en.pdf; Height: 0.8mm; Manufacturer_Part_Number: C1608C0G1H040C080AA; Arrow Part Number: C1608C0G1H040C080AA; Arrow Price/Stock: https://www.arrow.com/en/products/c1608c0g1h040c080aa/tdk
IC6 = MCP4728-E_UN: Integrated Circuit; Manufacturer_Name: Microchip; Manufacturer_Part_Number: MCP4728-E/UN; Datasheet Link: http://ww1.microchip.com/downloads/en/DeviceDoc/22187E.pdf; Height: 1.1mm; Mouser Part Number: 579-MCP4728-E/UN; Mouser Price/Stock: https://www.mouser.co.uk/ProductDetail/Microchip-Technology/MCP4728-E-UN?qs=E6wAi2XWqcP2zTenScklGA%3D%3D; Arrow Part Number: MCP4728-E/UN; Arrow Price/Stock: https://www.arrow.com/en/products/mcp4728-eun/microchip-technology?utm_currency=USD&region=nac
J87 J88 = CMP-2000-05181-2: as J7 on sheet LDO; Insulation Material: Nylon; Mount: Through Hole; RoHS Compliant: Yes; Series: THM; Height: 0.3inch; Termination: Through Hole; Material: Nylon; Packaging: Bulk; Contact Material: Bronze; REACH SVHC: No SVHC; Contact Plating: Silver; Orientation: Straight; Lead Free: Lead Free; Package Quantity: 100; Length: 7.62mm; Flammability Rating: UL94 V-0; Number of Contacts: 1; Diameter: 2.54mm; Housing Color: Black; Color: Black
LS1 = CPT-9019B-SMT-TR: Loudspeaker or Buzzer; Manufacturer_Name: Same Sky; Datasheet Link: https://www.sameskydevices.com/product/resource/supplyframepdf/cpt-9019b-smt-tr.pdf; Height: 2.1mm; Manufacturer_Part_Number: CPT-9019B-SMT-TR; Mouser Part Number: 179-CPT-9019B-SMT-TR; Mouser Price/Stock: https://www.mouser.co.uk/ProductDetail/CUI-Devices/CPT-9019B-SMT-TR?qs=3Rah4i%252BhyCGQOzp5C27TLw%3D%3D
R68-R71 = RT1206FRE0710KL: as R67 on sheet power; Part Number: RT1206FRE0710KL; ComponentLink1Description: Datasheet; ComponentLink1URL: https://www.yageo.com/upload/media/product/productsearch/datasheet/rchip/PYu-RT_1-to-0.01_RoHS_L_11.pdf; ComponentLink2Description: DigiKey Link; ComponentLink2URL: https://www.digikey.com/en/products/detail/yageo/RT1206FRE0710KL/1082868; Composition: Thin Film; Device Package: 1206 (3216 Metric); Height - Seated (Max): 0.026" (0.65mm); LastUpdated: 7/25/2024 09:21:28; Lifecycle Status: Active; Minimum Order: 1; Number of Terminations: 2; Operating Temperature: -55°C ~ 155°C; Package / Case: 1206 (3216 Metric); Packaging: TapeAndReel; PartId: 38903; Part Status: Active; Price: 0.01; Resistance: 10 kOhms; Series: RT; Size / Dimension: 0.122" L x 0.063" W (3.10mm x 1.60mm); Supplier 1: DigiKey; Supplier Part Number 1: YAG1242CT-ND; Supplier Device Package: 1206; Tolerance: ±1%; Value: 10 kOhms
S1-S4 = FSM4JSMA: as S5 on sheet MCU; Part Number: FSM4JSMA; Circuit: SPST-NO; ComponentLink1Description: Datasheet; ComponentLink1URL: https://www.te.com/commerce/DocumentDelivery/DDEController?Action=srchrtrv&DocNm=1308111-1_SWITCHES_CORE_PROGRAM_CATALOG&DocType=CS&DocLang=English; ComponentLink2Description: DigiKey Link; ComponentLink2URL: https://www.digikey.com/en/products/detail/te-connectivity-alcoswitch-switches/FSM4JSMA/525821; LastUpdated: 6/3/2024 20:19:31; Lifecycle Status: Active; Minimum Order: 1; Mounting Type: Surface Mount; Operating Temperature: -35°C ~ 85°C; Packaging: Bulk; Part Status: Active; Price: 0.14; Series: FSMJSMA; Supplier 1: DigiKey; Supplier Part Number 1: 450-1129-ND; Termination Style: Gull Wing
SW1 = PEC11R-4220F-S0012: ROTARY ENCODER MECHANICAL 12PPR; Built in Switch: Yes; Number of Channels: 2; Output Type: Quadrature; Hole Diameter: 7mm; Pulses per Revolution: 12; Termination: PC Pin; Package Quantity: 150; RoHS Compliant: Yes; Mount: Through Hole; Width: 12.5mm; Radiation Hardening: No; Number of Pins: 5; REACH SVHC: No SVHC; Type: Mechanical; Packaging: Bulk; Min Operating Temperature: -30°C; Encoder Type: Mechanical; Height: 13.4mm; Length: 26.5mm; Orientation: Vertical; Max Operating Temperature: 70°C; Series: PEC11R; Detent: Yes
Y1 = ECS-320-12-36B-CKY-TR: Crystal or Oscillator; Manufacturer_Name: ECS; Datasheet Link: https://www.ecsxtal.com/store/pdf/ECX-2236B.pdf; Height: 0mm; Manufacturer_Part_Number: ECS-320-12-36B-CKY-TR; Mouser Part Number: 520-320-12-36B-CKYT; Mouser Price/Stock: https://www.mouser.co.uk/ProductDetail/ECS/ECS-320-12-36B-CKY-TR?qs=l7cgNqFNU1juKISosFzRbg%3D%3D; Arrow Part Number: ECS-320-12-36B-CKY-TR; Arrow Price/Stock: https://www.arrow.com/en/products/ecs-320-12-36b-cky-tr/ecs-international